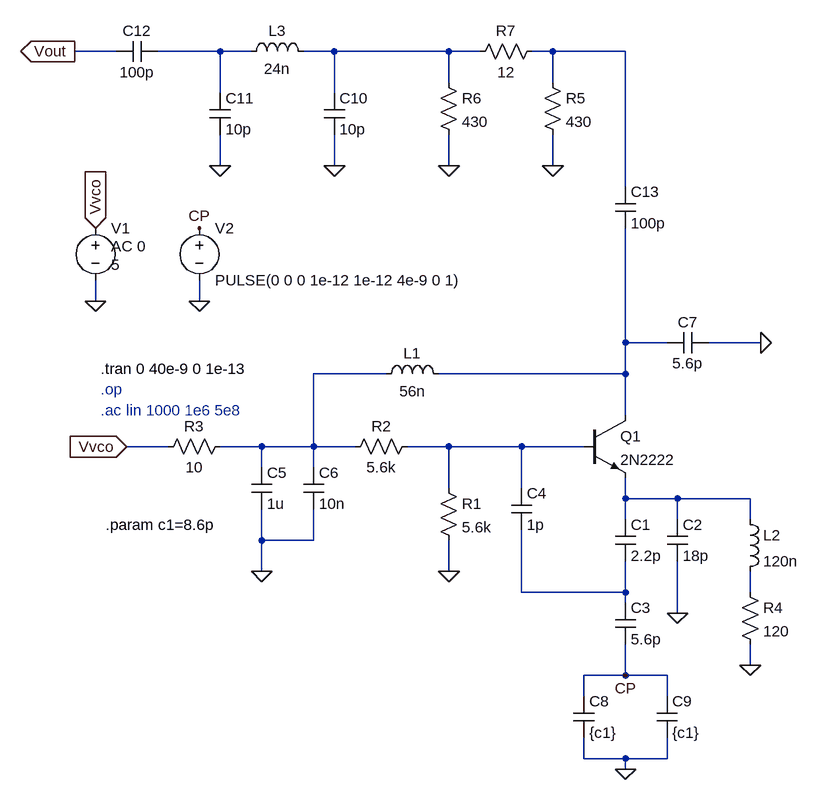
[diagram p0: schematic LO.asc]
LO.asc, the LTspice schematic file:
Version 4
SHEET 1 880 680
WIRE -576 -496 -640 -496
WIRE -416 -496 -512 -496
WIRE -368 -496 -416 -496
WIRE -240 -496 -288 -496
WIRE -64 -496 -240 -496
WIRE -16 -496 -64 -496
WIRE 96 -496 64 -496
WIRE 208 -496 96 -496
WIRE -64 -448 -64 -496
WIRE 96 -448 96 -496
WIRE -416 -432 -416 -496
WIRE -240 -432 -240 -496
WIRE -416 -320 -416 -368
WIRE -240 -320 -240 -368
WIRE -64 -320 -64 -368
WIRE 96 -320 96 -368
WIRE 208 -288 208 -496
WIRE -608 -112 -608 -144
WIRE -448 -112 -448 -144
WIRE 208 -48 208 -224
WIRE 272 -48 208 -48
WIRE 416 -48 336 -48
WIRE -160 0 -272 0
WIRE 208 0 208 -48
WIRE 208 0 -80 0
WIRE 208 64 208 0
WIRE -496 112 -560 112
WIRE -352 112 -416 112
WIRE -272 112 -272 0
WIRE -272 112 -352 112
WIRE -208 112 -272 112
WIRE -64 112 -128 112
WIRE 48 112 -64 112
WIRE 144 112 48 112
WIRE -352 144 -352 112
WIRE -272 144 -272 112
WIRE -64 176 -64 112
WIRE 48 176 48 112
WIRE 208 192 208 160
WIRE 288 192 208 192
WIRE 400 192 288 192
WIRE 208 224 208 192
WIRE 288 224 288 192
WIRE 400 224 400 192
WIRE -352 256 -352 208
WIRE -272 256 -272 208
WIRE -272 256 -352 256
WIRE -352 304 -352 256
WIRE -64 304 -64 256
WIRE 48 336 48 240
WIRE 208 336 208 288
WIRE 208 336 48 336
WIRE 400 336 400 304
WIRE 208 352 208 336
WIRE 288 368 288 288
WIRE 400 448 400 416
WIRE 208 464 208 416
WIRE 208 464 144 464
WIRE 272 464 208 464
WIRE 144 496 144 464
WIRE 272 496 272 464
WIRE 144 592 144 560
WIRE 208 592 144 592
WIRE 272 592 272 560
WIRE 272 592 208 592
WIRE 208 608 208 592
FLAG 288 368 0
FLAG 400 448 0
FLAG -64 304 0
FLAG -352 304 0
FLAG 416 -48 0
FLAG -560 112 Vvco
IOPIN -560 112 In
FLAG -640 -496 Vout
IOPIN -640 -496 Out
FLAG -608 -112 0
FLAG -608 -224 Vvco
IOPIN -608 -224 In
FLAG 208 608 0
FLAG -448 -112 0
FLAG -448 -224 CP
FLAG 208 464 CP
FLAG -64 -320 0
FLAG 96 -320 0
FLAG -240 -320 0
FLAG -416 -320 0
SYMBOL cap 192 224 R0
SYMATTR InstName C1
SYMATTR Value 2.2p
SYMBOL cap 272 224 R0
SYMATTR InstName C2
SYMATTR Value 18p
SYMBOL cap 192 352 R0
SYMATTR InstName C3
SYMATTR Value 5.6p
SYMBOL cap 32 176 R0
SYMATTR InstName C4
SYMATTR Value 1p
SYMBOL ind -176 16 R270
WINDOW 0 32 56 VTop 2
WINDOW 3 5 56 VBottom 2
SYMATTR InstName L1
SYMATTR Value 56n
SYMBOL res -80 160 R0
SYMATTR InstName R1
SYMATTR Value 5.6k
SYMBOL res -112 96 R90
WINDOW 0 0 56 VBottom 2
WINDOW 3 32 56 VTop 2
SYMATTR InstName R2
SYMATTR Value 5.6k
SYMBOL res -400 96 R90
WINDOW 0 0 56 VBottom 2
WINDOW 3 32 56 VTop 2
SYMATTR InstName R3
SYMATTR Value 10
SYMBOL cap -368 144 R0
SYMATTR InstName C5
SYMATTR Value 1u
SYMBOL cap -288 144 R0
SYMATTR InstName C6
SYMATTR Value 10n
SYMBOL ind 384 208 R0
SYMATTR InstName L2
SYMATTR Value 120n
SYMBOL res 384 320 R0
SYMATTR InstName R4
SYMATTR Value 120
SYMBOL cap 336 -64 R90
WINDOW 0 0 32 VBottom 2
WINDOW 3 32 32 VTop 2
SYMATTR InstName C7
SYMATTR Value 5.6p
SYMBOL voltage -608 -240 R0
WINDOW 123 24 44 Left 2
WINDOW 39 0 0 Left 0
WINDOW 3 24 72 Left 2
SYMATTR Value2 AC 0
SYMATTR InstName V1
SYMATTR Value 5
SYMBOL voltage -448 -240 R0
WINDOW 123 0 0 Left 0
WINDOW 39 0 0 Left 0
SYMATTR InstName V2
SYMATTR Value PULSE(0 0 0 1e-12 1e-12 4e-9 0 1)
SYMBOL cap 128 496 R0
SYMATTR InstName C8
SYMATTR Value {c1}
SYMBOL cap 256 496 R0
SYMATTR InstName C9
SYMATTR Value {c1}
SYMBOL res 80 -464 R0
SYMATTR InstName R5
SYMATTR Value 430
SYMBOL res -80 -464 R0
SYMATTR InstName R6
SYMATTR Value 430
SYMBOL res 80 -512 R90
WINDOW 0 0 56 VBottom 2
WINDOW 3 32 56 VTop 2
SYMATTR InstName R7
SYMATTR Value 12
SYMBOL cap -256 -432 R0
SYMATTR InstName C10
SYMATTR Value 10p
SYMBOL cap -432 -432 R0
SYMATTR InstName C11
SYMATTR Value 10p
SYMBOL ind -384 -480 R270
WINDOW 0 32 56 VTop 2
WINDOW 3 5 56 VBottom 2
SYMATTR InstName L3
SYMATTR Value 24n
SYMBOL cap -512 -512 R90
WINDOW 0 0 32 VBottom 2
WINDOW 3 32 32 VTop 2
SYMATTR InstName C12
SYMATTR Value 100p
SYMBOL cap 192 -288 R0
SYMATTR InstName C13
SYMATTR Value 100p
SYMBOL npn 144 64 R0
SYMATTR InstName Q1
SYMATTR Value 2N2222
TEXT -600 -8 Left 2 !.tran 0 40e-9 0 1e-13
TEXT -592 232 Left 2 !.param c1=8.6p
TEXT -600 24 Left 2 ;.op
TEXT -600 56 Left 2 ;.ac lin 1000 1e6 5e8

The netlist it stands for:
* LO.asc
C1 N007 N008 2.2p
C2 N007 0 18p
C3 N008 CP 5.6p
C4 N006 N008 1p
L1 N005 N004 56n
R1 N006 0 5.6k
R2 N006 N005 5.6k
R3 N005 Vvco 10
C5 N005 0 1u
C6 N005 0 10n
L2 N007 N009 120n
R4 N009 0 120
C7 0 N004 5.6p
V1 Vvco 0 5 AC 0
V2 CP 0 PULSE(0 0 0 1e-12 1e-12 4e-9 0 1)
C8 CP 0 {c1}
C9 CP 0 {c1}
R5 N003 0 430
R6 N002 0 430
R7 N003 N002 12
C10 N002 0 10p
C11 N001 0 10p
L3 N001 N002 24n
C12 N001 Vout 100p
C13 N003 N004 100p
Q1 N004 N006 N007 0 2N2222
.model NPN NPN
.model PNP PNP
.lib standard.bjt
.tran 0 40e-9 0 1e-13
.param c1=8.6p
* .op
* .ac lin 1000 1e6 5e8
.backanno
.end